# EasyEDA schematic 1-Schematic_video_multiple.json
TITLE: 2x3 video multiple; REV: 1.0; Date: 2025-03-21; Sheet: 1/1; Drawn By: Tilman; Company: TekNoiseLab
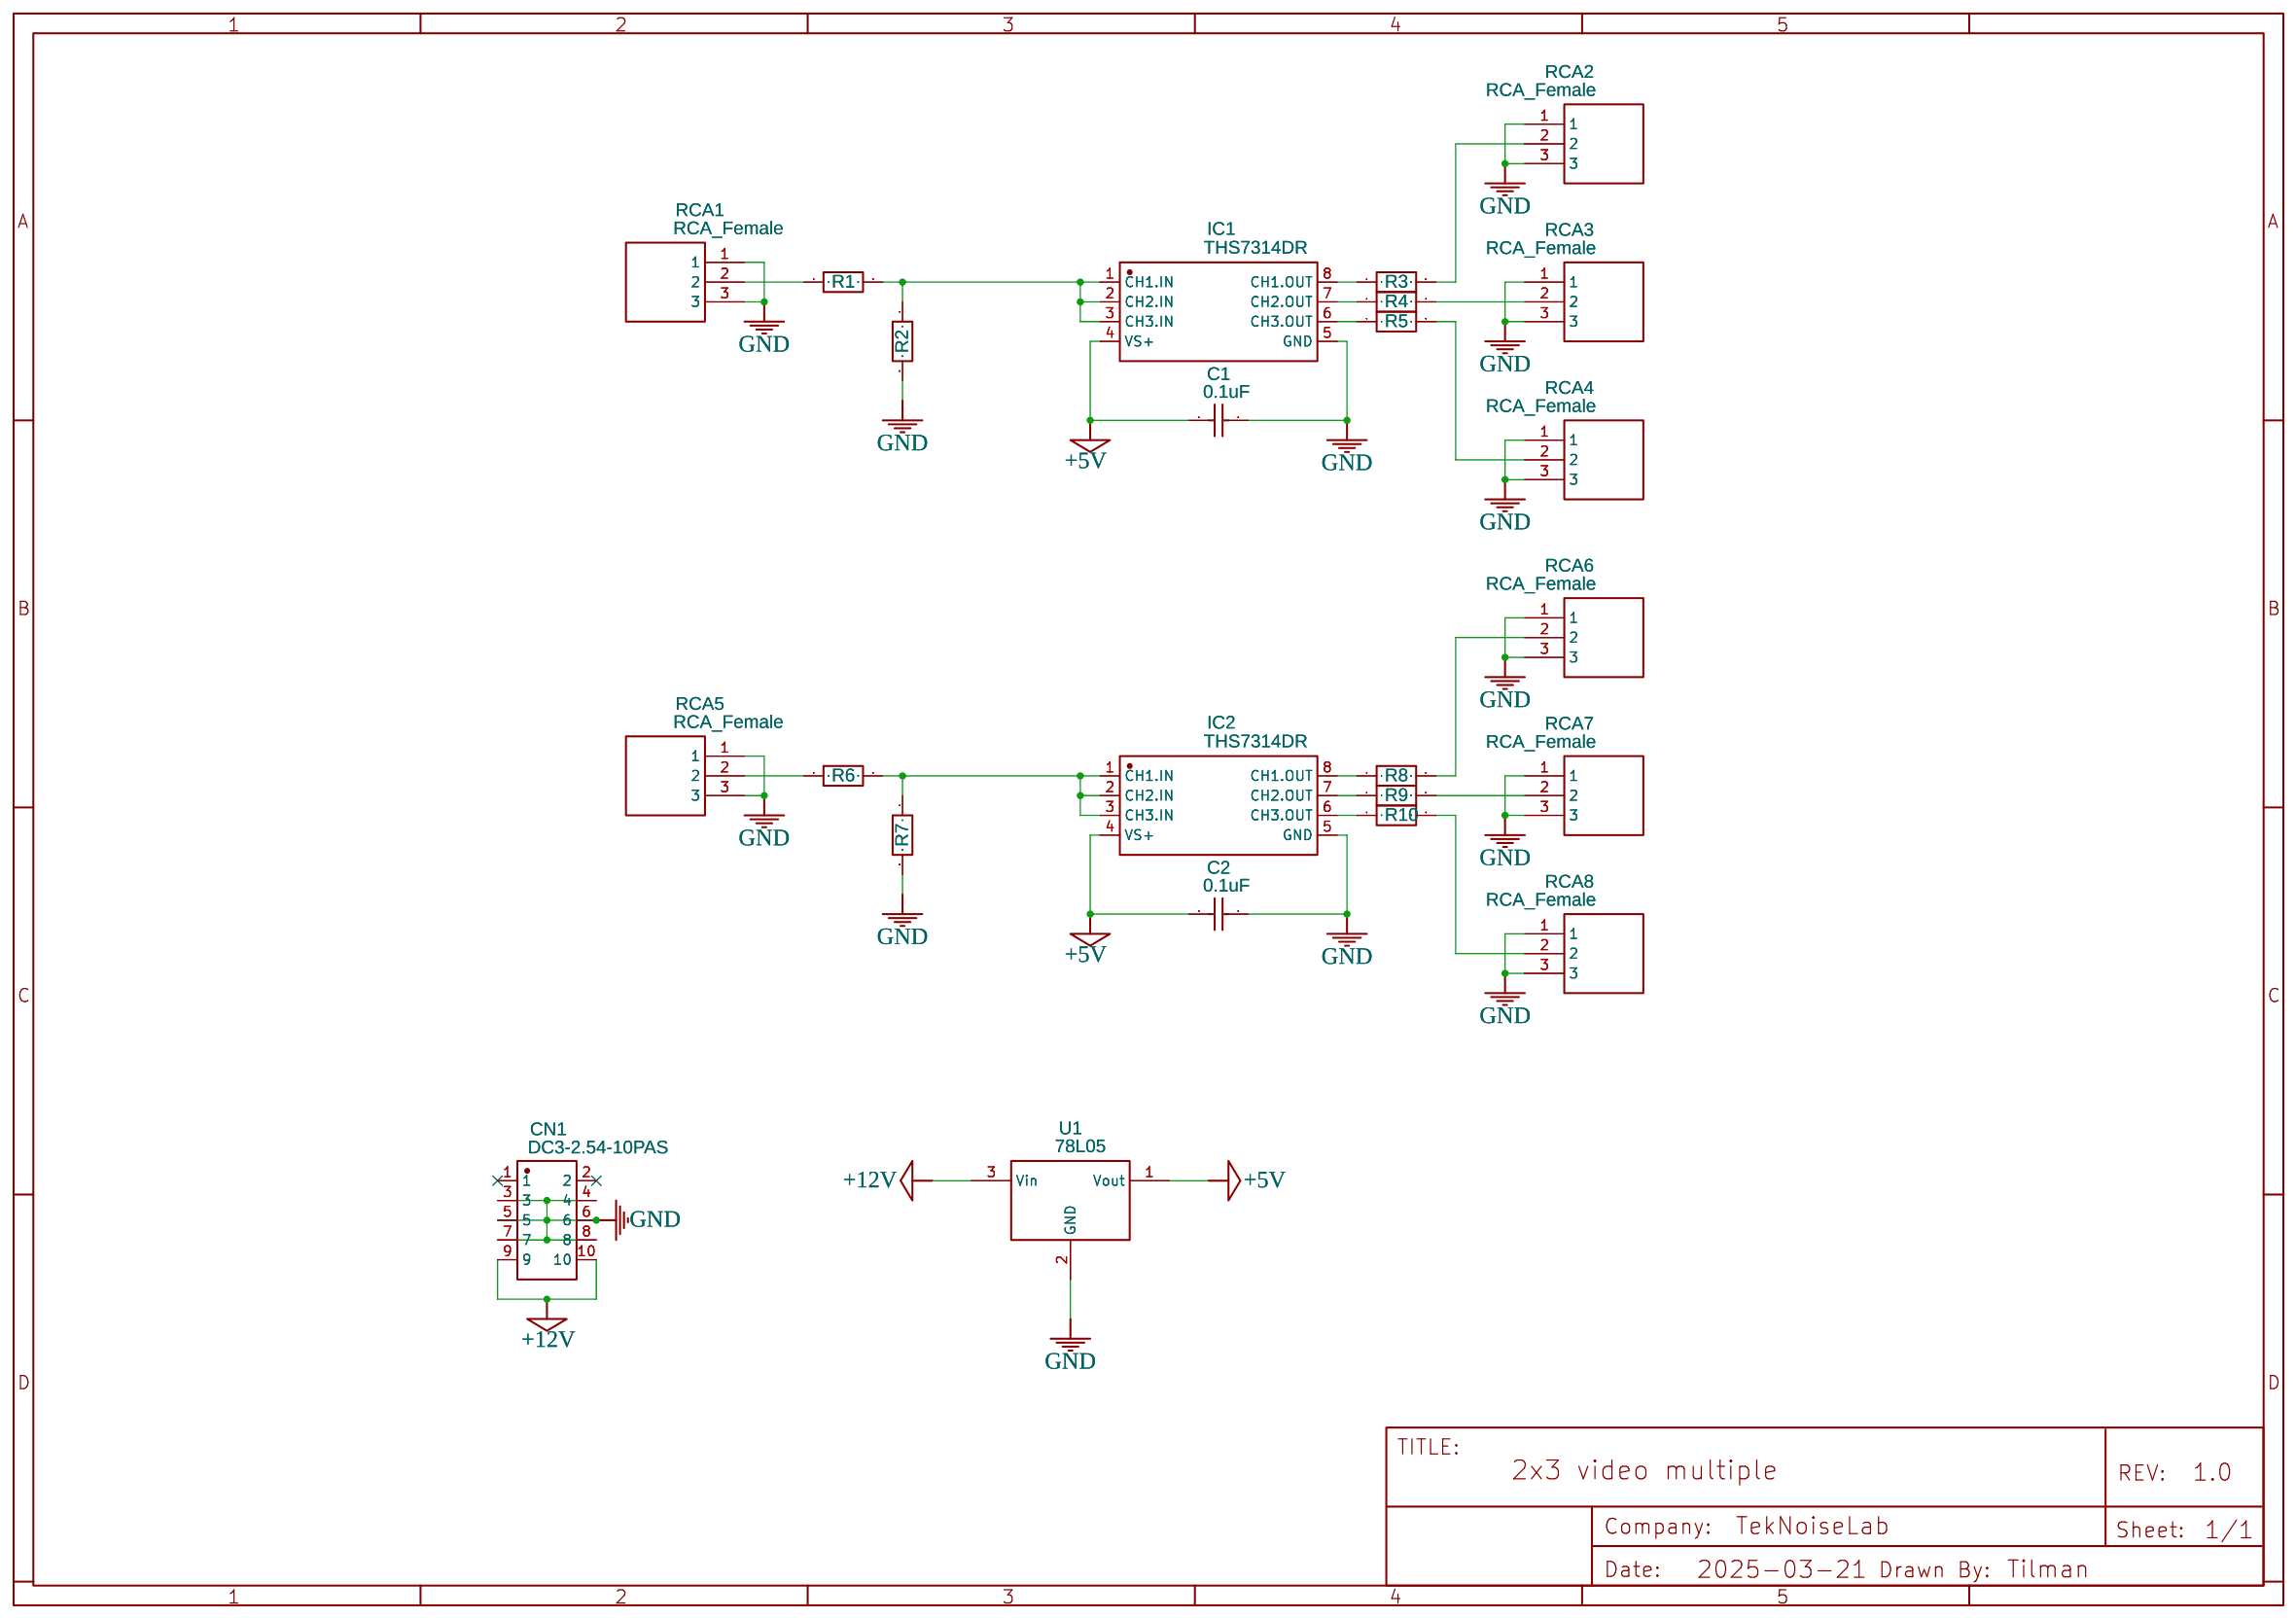
[diagram p0: schematic sheet]

## Parts
C1  0.1uF  [CAP-2.5*6.5*7.2]
C2  0.1uF  [CAP-2.5*6.5*7.2]
CN1  DC3-2.54-10PAS  [CONN-TH_10P-P2.54_DC3-2.54-10PAS]
IC1  THS7314DR  [SOP-8_L4.9-W3.9-P1.27-LS6.0-BL]
IC2  THS7314DR  [SOP-8_L4.9-W3.9-P1.27-LS6.0-BL]
R1  75  [RES-TH_BD2.4-L6.3-P10.30-D0.6]
R2  75  [RES-TH_BD2.4-L6.3-P10.30-D0.6]
R3  75  [RES-TH_BD2.4-L6.3-P10.30-D0.6]
R4  75  [RES-TH_BD2.4-L6.3-P10.30-D0.6]
R5  75  [RES-TH_BD2.4-L6.3-P10.30-D0.6]
R6  75  [RES-TH_BD2.4-L6.3-P10.30-D0.6]
R7  75  [RES-TH_BD2.4-L6.3-P10.30-D0.6]
R8  75  [RES-TH_BD2.4-L6.3-P10.30-D0.6]
R9  75  [RES-TH_BD2.4-L6.3-P10.30-D0.6]
R10  75  [RES-TH_BD2.4-L6.3-P10.30-D0.6]
RCA1  RCA_Female  [RCA_FEMALE]
RCA2  RCA_Female  [RCA_FEMALE]
RCA3  RCA_Female  [RCA_FEMALE]
RCA4  RCA_Female  [RCA_FEMALE]
RCA5  RCA_Female  [RCA_FEMALE]
RCA6  RCA_Female  [RCA_FEMALE]
RCA7  RCA_Female  [RCA_FEMALE]
RCA8  RCA_Female  [RCA_FEMALE]
U1  78L05  [TO-92-3_L4.8-W3.7-P2.54-L]

## Library data of the parts
C1 C2 = 0.22uF 5% 100VCalibration capacitor: Supplier Part: undefined; Supplier: LCSC; Manufacturer: ReliaPro
CN1 = DC3-2.54-10PAS: Contributor: lcsc; Supplier: LCSC; Supplier Part: C2977596; Manufacturer: ZHOURI(洲日); JLCPCB Part Class: Extended Part
IC1 IC2 = THS7314DR: Supplier: LCSC; Supplier Part: C882751; Manufacturer: TI(德州仪器); JLCPCB Part Class: Extended Part; Contributor: lcsc
R1-R10 = Res_AXIAL-0.4(1/4W)_US
RCA1-RCA8 = RCA_Female: Supplier: Digi-Key; Contributor: gellis
U1 = SN78L05AT: Contributor: LCSC; Supplier: LCSC; Supplier Part: C245027; Manufacturer: KODENSHI AUK(光电子); JLCPCB Part Class: Extended Part

## Nets
+5V: C1.1 C2.1 IC1.4(VS+) IC2.4(VS+) U1.1(Vout)
+12V: CN1.9 CN1.10 U1.3(Vin)
GND: C1.2 C2.2 CN1.3 CN1.4 CN1.5 CN1.6 CN1.7 CN1.8 IC1.5(GND) IC2.5(GND) R2.2 R7.2 RCA1.1 RCA1.3 RCA2.1 RCA2.3 RCA3.1 RCA3.3 RCA4.1 RCA4.3 RCA5.1 RCA5.3 RCA6.1 RCA6.3 RCA7.1 RCA7.3 RCA8.1 RCA8.3 U1.2(GND)
Net-(IC1-1): IC1.1(CH1.IN) IC1.2(CH2.IN) IC1.3(CH3.IN) R1.2 R2.1
Net-(IC1-6): IC1.6(CH3.OUT) R5.1
Net-(IC1-7): IC1.7(CH2.OUT) R4.1
Net-(IC1-8): IC1.8(CH1.OUT) R3.1
Net-(IC2-1): IC2.1(CH1.IN) IC2.2(CH2.IN) IC2.3(CH3.IN) R6.2 R7.1
Net-(IC2-6): IC2.6(CH3.OUT) R10.1
Net-(IC2-7): IC2.7(CH2.OUT) R9.1
Net-(IC2-8): IC2.8(CH1.OUT) R8.1
Net-(R1-1): R1.1 RCA1.2
Net-(R3-2): R3.2 RCA2.2
Net-(R4-2): R4.2 RCA3.2
Net-(R5-2): R5.2 RCA4.2
Net-(R6-1): R6.1 RCA5.2
Net-(R8-2): R8.2 RCA6.2
Net-(R9-2): R9.2 RCA7.2
Net-(R10-2): R10.2 RCA8.2

Not connected (* = marked no-connect by the designer): CN1 1* 2*
